# Altium schematic sheet top_level.SchDoc
size A4
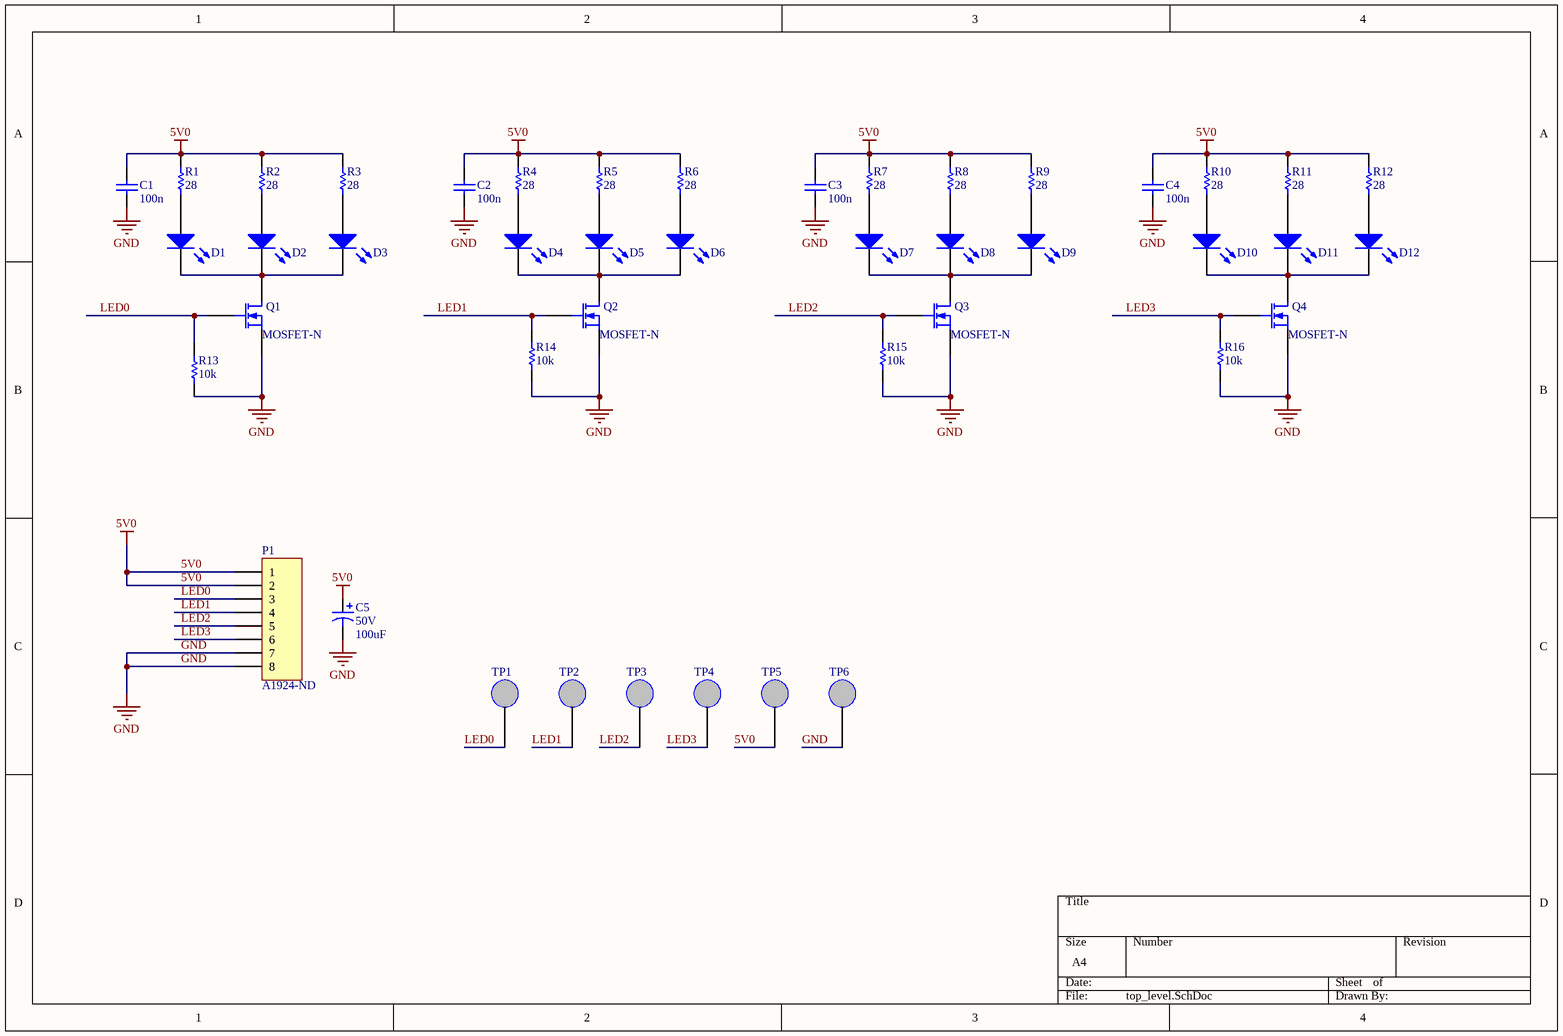
[diagram p0: top_level.SchDoc]

## Parts
C1  value 100n  [CS-0603]  (hidden comment: CS - CAPACITOR)
C2  value 100n  [CS-0603]  (hidden comment: CS - CAPACITOR)
C3  value 100n  [CS-0603]  (hidden comment: CS - CAPACITOR)
C4  value 100n  [CS-0603]  (hidden comment: CS - CAPACITOR)
C5  value 100uF  VOLTAGE: 50V  [CT-CAP-ALUM-8X14]  (hidden comment: CT - CAPACITOR ELECTROLYTIC)
D1  LED - NORMAL LED  [LED-1]  (value not drawn)
D2  LED - NORMAL LED  [LED-1]  (value not drawn)
D3  LED - NORMAL LED  [LED-1]  (value not drawn)
D4  LED - NORMAL LED  [LED-1]  (value not drawn)
D5  LED - NORMAL LED  [LED-1]  (value not drawn)
D6  LED - NORMAL LED  [LED-1]  (value not drawn)
D7  LED - NORMAL LED  [LED-1]  (value not drawn)
D8  LED - NORMAL LED  [LED-1]  (value not drawn)
D9  LED - NORMAL LED  [LED-1]  (value not drawn)
D10  LED - NORMAL LED  [LED-1]  (value not drawn)
D11  LED - NORMAL LED  [LED-1]  (value not drawn)
D12  LED - NORMAL LED  [LED-1]  (value not drawn)
P1  Supplier Part Number 1: A1924-ND  [CON-HEADER-1X8]  (hidden comment: CON - HEADER 1X8)
Q1  MOSFET-N  [TO-220AB]
Q2  MOSFET-N  [TO-220AB]
Q3  MOSFET-N  [TO-220AB]
Q4  MOSFET-N  [TO-220AB]
R1  value 28  [RS-1210]  (hidden comment: RS - RESISTOR)
R2  value 28  [RS-1210]  (hidden comment: RS - RESISTOR)
R3  value 28  [RS-1210]  (hidden comment: RS - RESISTOR)
R4  value 28  [RS-1210]  (hidden comment: RS - RESISTOR)
R5  value 28  [RS-1210]  (hidden comment: RS - RESISTOR)
R6  value 28  [RS-1210]  (hidden comment: RS - RESISTOR)
R7  value 28  [RS-1210]  (hidden comment: RS - RESISTOR)
R8  value 28  [RS-1210]  (hidden comment: RS - RESISTOR)
R9  value 28  [RS-1210]  (hidden comment: RS - RESISTOR)
R10  value 28  [RS-1210]  (hidden comment: RS - RESISTOR)
R11  value 28  [RS-1210]  (hidden comment: RS - RESISTOR)
R12  value 28  [RS-1210]  (hidden comment: RS - RESISTOR)
R13  value 10k  [RS-0603]  (hidden comment: RS - RESISTOR)
R14  value 10k  [RS-0603]  (hidden comment: RS - RESISTOR)
R15  value 10k  [RS-0603]  (hidden comment: RS - RESISTOR)
R16  value 10k  [RS-0603]  (hidden comment: RS - RESISTOR)
TP1  5003K  [TP - VERTICAL]  (value not drawn)
TP2  5003K  [TP - VERTICAL]  (value not drawn)
TP3  5003K  [TP - VERTICAL]  (value not drawn)
TP4  5003K  [TP - VERTICAL]  (value not drawn)
TP5  5003K  [TP - VERTICAL]  (value not drawn)
TP6  5003K  [TP - VERTICAL]  (value not drawn)

## Nets
5V0: C1.1 C2.1 C3.1 C4.1 C5.1 P1.1 P1.2 R1.2 R2.2 R3.2 R4.2 R5.2 R6.2 R7.2 R8.2 R9.2 R10.2 R11.2 R12.2 TP5.1
GND: C1.2 C2.2 C3.2 C4.2 C5.2 P1.7 P1.8 Q1.3(S) Q2.3(S) Q3.3(S) Q4.3(S) R13.1 R14.1 R15.1 R16.1 TP6.1
LED0: P1.3 Q1.2(G) R13.2 TP1.1
LED1: P1.4 Q2.2(G) R14.2 TP2.1
LED2: P1.5 Q3.2(G) R15.2 TP3.1
LED3: P1.6 Q4.2(G) R16.2 TP4.1
NetD1_A: D1.A R1.1
NetD1_K: D1.K D2.K D3.K Q1.1(D)
NetD2_A: D2.A R2.1
NetD3_A: D3.A R3.1
NetD4_A: D4.A R4.1
NetD4_K: D4.K D5.K D6.K Q2.1(D)
NetD5_A: D5.A R5.1
NetD6_A: D6.A R6.1
NetD7_A: D7.A R7.1
NetD7_K: D7.K D8.K D9.K Q3.1(D)
NetD8_A: D8.A R8.1
NetD9_A: D9.A R9.1
NetD10_A: D10.A R10.1
NetD10_K: D10.K D11.K D12.K Q4.1(D)
NetD11_A: D11.A R11.1
NetD12_A: D12.A R12.1

## Library data of the parts
C1-C4 = CS - CAPACITOR: TOLERANCE: 10%; VOLTAGE: 16V; Supplier 1: *; Supplier Part Number 1: *; (FIELD A): *; (FLIED C): *; (FIELD B): *; Manufacturer: *
C5 = CT - CAPACITOR ELECTROLYTIC: TOLERANCE: 10%; Supplier 1: *; Supplier Part Number 1: *; (FIELD A): *; (FLIED C): *; (FIELD B): *; Manufacturer: *
P1 = CON - HEADER 1X8: 100mil header 1 row 6 pins; Manufacturer: *; (FIELD A): *; (FIELD B): *; (FIELD C): *; Supplier 1: Digi-Key
Q1-Q4 = MOSFET-N: N-Channel MOSFET; Published: 8-Jun-2000; LatestRevisionDate: 17-Jul-2002; LatestRevisionNote: Re-released for DXP Platform.; PackageVersion: 1995/1996; PackageReference: E3; Publisher: Altium Limited; PackageDescription: TO, Flat Index; 3 In-Line, Axial Leads; Body Dia. 4.6mm; Lead Dia. 0.5 mm (max); Supplier name: Digikey; Supplier Part Number: IRFI530NPBF-ND
R1-R16 = RS - RESISTOR: TOLERANCE: RES TOL; POWER: RES POWER; (FIELD A): *; (FLIED C): *; (FIELD B): *; Manufacturer: *
  R1-R12: Supplier Part Number 1: P28.0AACT-ND; Supplier 1: Digikey
  R13-R16: Supplier Part Number 1: *; Supplier 1: *
TP1-TP6 = TP - Test point vertical: (FIELD A): *; (FIELD B): *; (FIELD C): *; Manufacturer: *; Supplier 1: Newark; Supplier Part Number 1: 62W5140
D1-D12 = LED - NORMAL LED: FORWARS VOLTAGE: *; CURRENT: *; COLOR: *; Supplier Part Number 1: VLCS5830-ND; Supplier 1: Digikey; (FIELD B): *; (FIELD A): *; (FIELD C): *; Manufacturer: *